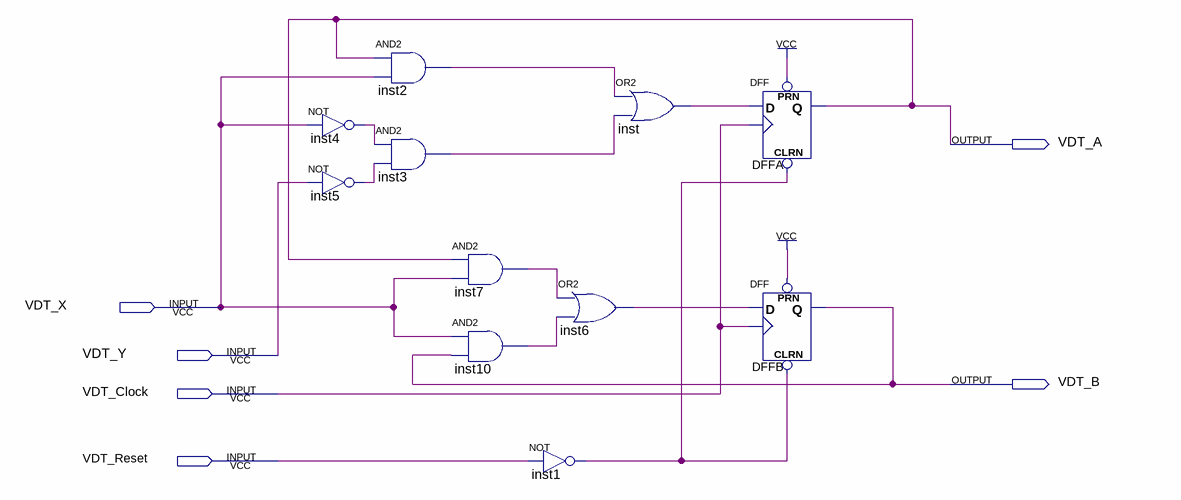
[diagram p0: schematic sheet]
// Quartus schematic assignment3.bdf as structural Verilog: 11 symbols, 6 pins
module assignment3 (
  input  VDT_X,
  input  VDT_Y,
  input  VDT_Clock,
  input  VDT_Reset,
  output VDT_A,
  output VDT_B
);

  wire inst1_out, inst2_out, inst3_out, inst4_out, inst5_out, inst6_out, inst7_out, inst10_out, inst_out;

  not inst4 (inst4_out, VDT_X);
  not inst5 (inst5_out, VDT_Y);
  and inst2 (inst2_out, VDT_A, VDT_X);
  and inst3 (inst3_out, inst4_out, inst5_out);
  and inst7 (inst7_out, VDT_A, VDT_X);
  and inst10 (inst10_out, VDT_X, VDT_B);
  not inst1 (inst1_out, VDT_Reset);
  or inst (inst_out, inst2_out, inst3_out);
  or inst6 (inst6_out, inst7_out, inst10_out);
  DFF DFFA (.CLRN(inst1_out), .CLK(VDT_Clock), .D(inst_out), .PRN(1'b1), .Q(VDT_A));
  DFF DFFB (.CLRN(inst1_out), .CLK(VDT_Clock), .D(inst6_out), .PRN(1'b1), .Q(VDT_B));
endmodule
